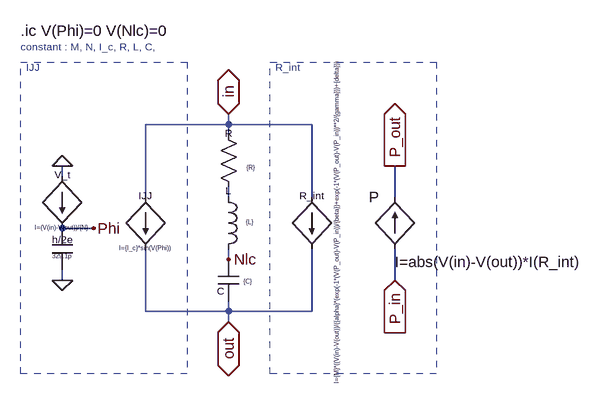
[diagram p0: schematic 1stack.asc]
1stack.asc, the LTspice schematic file:
Version 4
SHEET 1 880 680
WIRE 224 16 224 0
WIRE 224 16 96 16
WIRE 352 16 224 16
WIRE 224 32 224 16
WIRE -32 96 -32 80
WIRE 96 128 96 16
WIRE 224 128 224 112
WIRE 352 128 352 16
WIRE 480 128 480 80
WIRE 16 176 -32 176
WIRE 224 224 224 208
WIRE -32 256 -32 240
WIRE 480 256 480 208
WIRE 96 304 96 208
WIRE 224 304 224 288
WIRE 224 304 96 304
WIRE 352 304 352 208
WIRE 352 304 224 304
WIRE 224 320 224 304
FLAG 224 0 in
IOPIN 224 0 BiDir
FLAG 224 320 out
IOPIN 224 320 BiDir
FLAG 480 80 P_out
IOPIN 480 80 Out
FLAG 480 256 P_in
IOPIN 480 256 In
FLAG -32 80 0
FLAG -32 256 0
FLAG 16 176 Phi
FLAG 224 224 Nlc
SYMBOL bi 96 128 R0
WINDOW 0 0 8 Bottom 1
WINDOW 3 0 72 Top 0
SYMATTR InstName IJJ
SYMATTR Value I={I_c}*sin(V(Phi))
SYMBOL bi 352 128 R0
WINDOW 0 0 8 Bottom 1
WINDOW 3 32 32 VTop 0
SYMATTR InstName R_int
SYMATTR Value I={M}*((V(in)-V(out))/({alpha}*(exp(-1*(V(P_out)-V(P_in))/{beta})+exp(-1*(V(P_out)-V(P_in))**2/{gamma}))+{delta}))
SYMBOL res 208 16 R0
WINDOW 0 16 24 Bottom 1
WINDOW 3 51 60 Top 0
SYMATTR InstName R
SYMATTR Value {R}
SYMBOL cap 208 224 R0
WINDOW 0 4 38 Top 1
WINDOW 3 46 27 Top 0
SYMATTR InstName C
SYMATTR Value {C}
SYMBOL bi 480 208 R180
WINDOW 0 24 80 Left 2
WINDOW 3 -290 -20 Left 2
SYMATTR InstName P
SYMATTR Value I=abs(V(in)-V(out))*I(R_int)
SYMBOL bi -32 96 R0
WINDOW 0 0 8 Bottom 1
WINDOW 3 0 72 Top 0
SYMATTR InstName V_t
SYMATTR Value I=(V(in)-V(out))/{N}
SYMBOL cap -48 176 R0
WINDOW 0 16 28 Bottom 1
WINDOW 3 16 36 Top 0
SYMATTR InstName h/2e
SYMATTR Value 329.1p
SYMBOL ind 208 112 R0
WINDOW 0 16 16 Bottom 1
WINDOW 3 49 48 Top 0
SYMATTR InstName L
SYMATTR Value {L}
TEXT -96 -104 Left 1 ;constant : M, N, I_c, R, L, C,
TEXT -88 -72 Left 1 ;IJJ
TEXT 296 -72 Left 1 ;R_int
TEXT -96 -128 Left 2 !.ic V(Phi)=0 V(Nlc)=0
RECTANGLE Normal -96 -80 160 400 2
RECTANGLE Normal 544 400 288 -80 2

The netlist it stands for:
* 1stack.asc
B§IJJ in out I={I_c}*sin(V(Phi))
B§R_int in out I={M}*((V(in)-V(out))/({alpha}*(exp(-1*(V(P_out)-V(P_in))/{beta})+exp(-1*(V(P_out)-V(P_in))**2/{gamma}))+{delta}))
R in N001 {R}
C Nlc out {C}
B§P P_in P_out I=abs(V(in)-V(out))*I(R_int)
B§V_t 0 Phi I=(V(in)-V(out))/{N}
C§h/2e Phi 0 329.1p
L N001 Nlc {L}
* constant : M, N, I_c, R, L, C,
* IJJ
* R_int
.ic V(Phi)=0 V(Nlc)=0
.backanno
.end